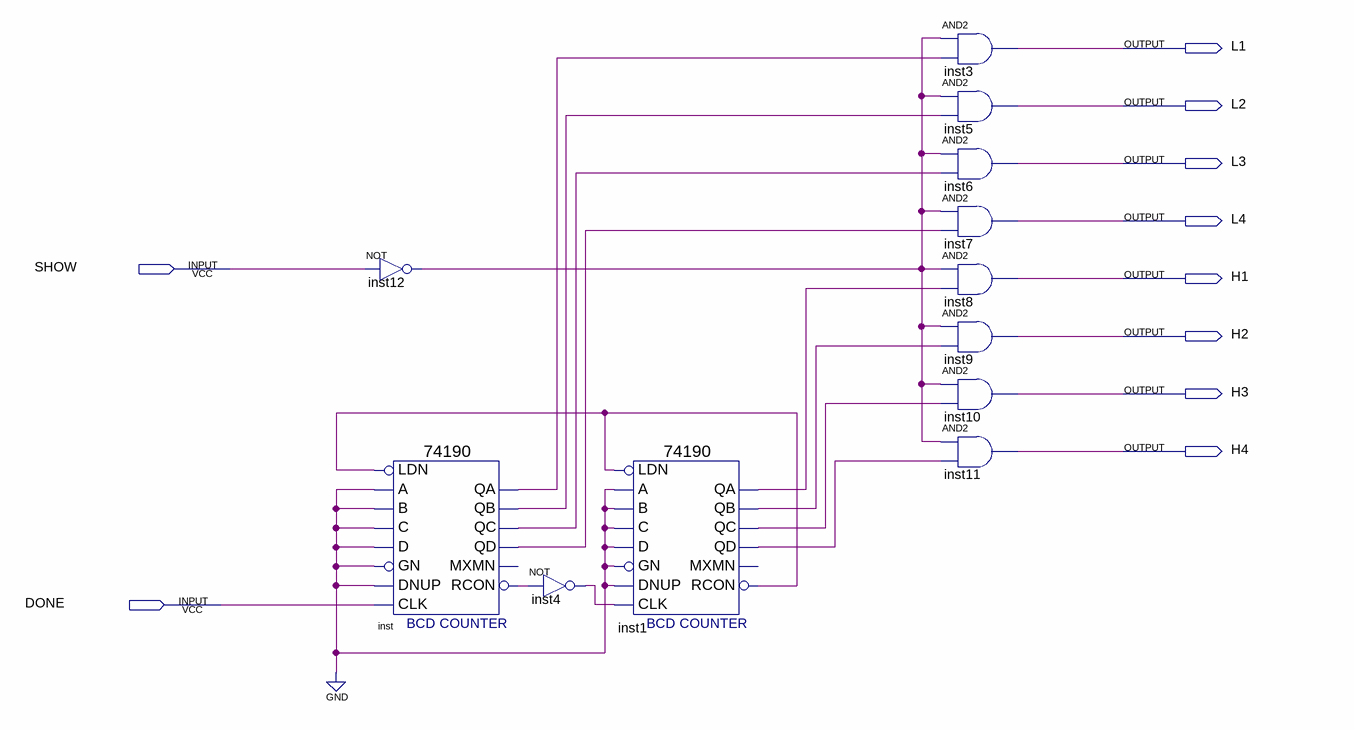
[diagram p0: schematic sheet]
// Quartus schematic 100counter.bdf as structural Verilog: 12 symbols, 10 pins
module \100counter  (
  input  SHOW,
  input  DONE,
  output L1,
  output L2,
  output L3,
  output L4,
  output H1,
  output H2,
  output H3,
  output H4
);

  wire inst1_qa, inst1_qb, inst1_qc, inst1_qd, inst1_rcon, inst4_out, inst12_out, inst_qa, inst_qb, inst_qc,
       inst_qd, inst_rcon;

  not inst12 (inst12_out, SHOW);
  \74190  inst (
    .LDN(inst1_rcon), .A(1'b0), .C(1'b0), .B(1'b0), .D(1'b0), .GN(1'b0), .CLK(DONE), .DNUP(1'b0),
    .QA(inst_qa), .QB(inst_qb), .QD(inst_qd), .QC(inst_qc), .RCON(inst_rcon));  // open: MXMN
  not inst4 (inst4_out, inst_rcon);
  \74190  inst1 (
    .LDN(inst1_rcon), .A(1'b0), .C(1'b0), .B(1'b0), .D(1'b0), .GN(1'b0), .CLK(inst4_out), .DNUP(1'b0),
    .QA(inst1_qa), .QB(inst1_qb), .QD(inst1_qd), .QC(inst1_qc), .RCON(inst1_rcon));  // open: MXMN
  and inst3 (L1, inst12_out, inst_qa);
  and inst5 (L2, inst12_out, inst_qb);
  and inst6 (L3, inst12_out, inst_qc);
  and inst7 (L4, inst12_out, inst_qd);
  and inst8 (H1, inst12_out, inst1_qa);
  and inst9 (H2, inst12_out, inst1_qb);
  and inst10 (H3, inst12_out, inst1_qc);
  and inst11 (H4, inst12_out, inst1_qd);
endmodule
